# EAGLE board tester (EAGLE 6.4)
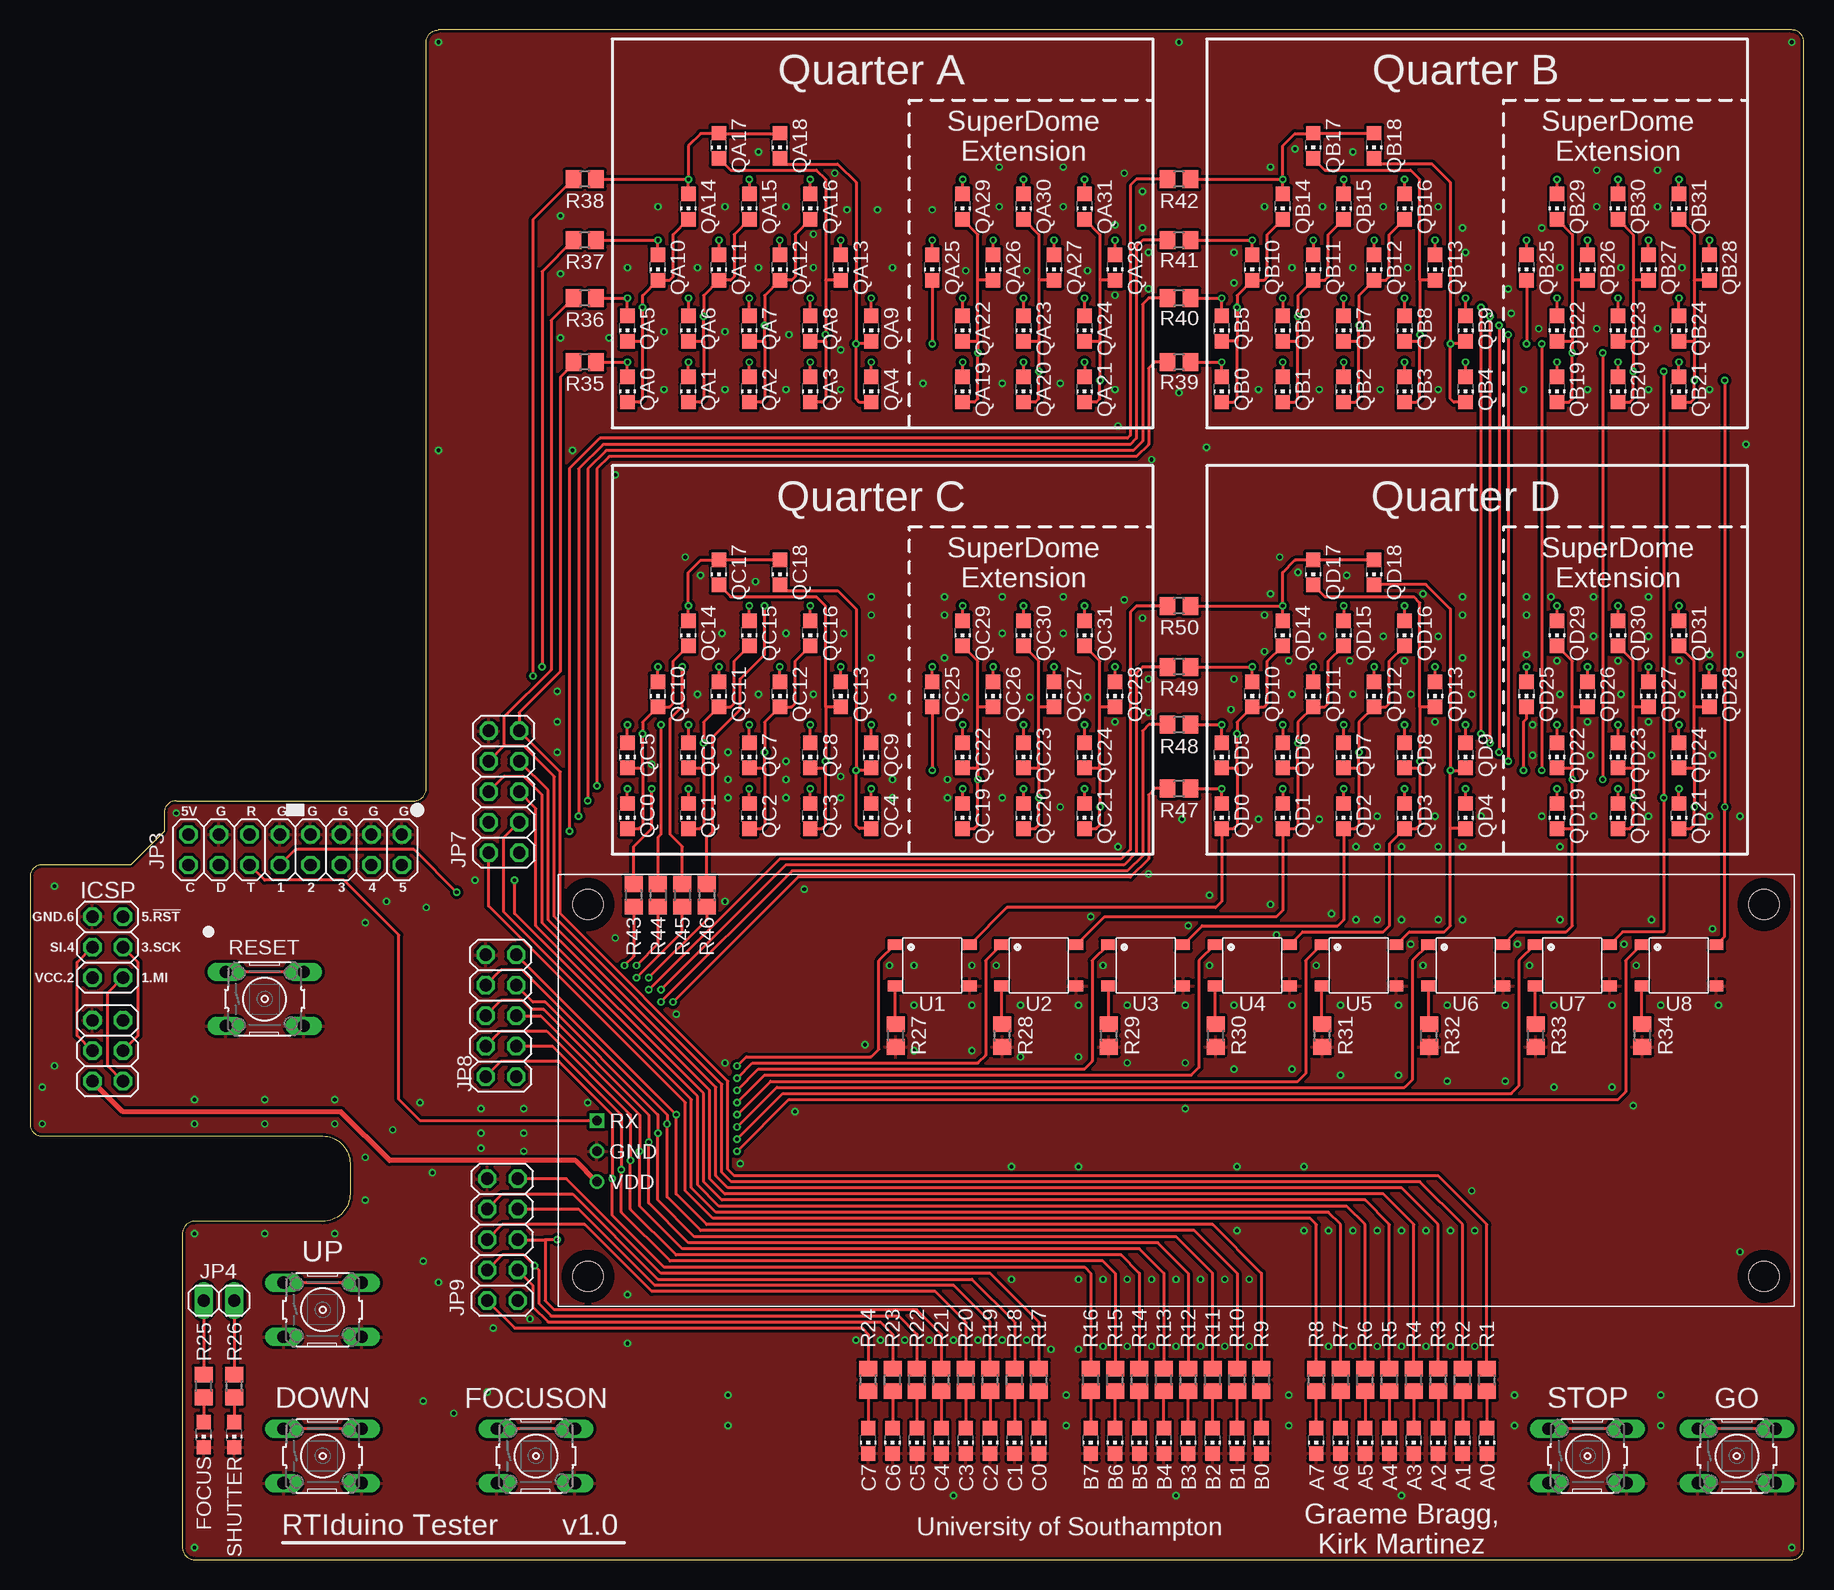
[diagram p2: board, top side]
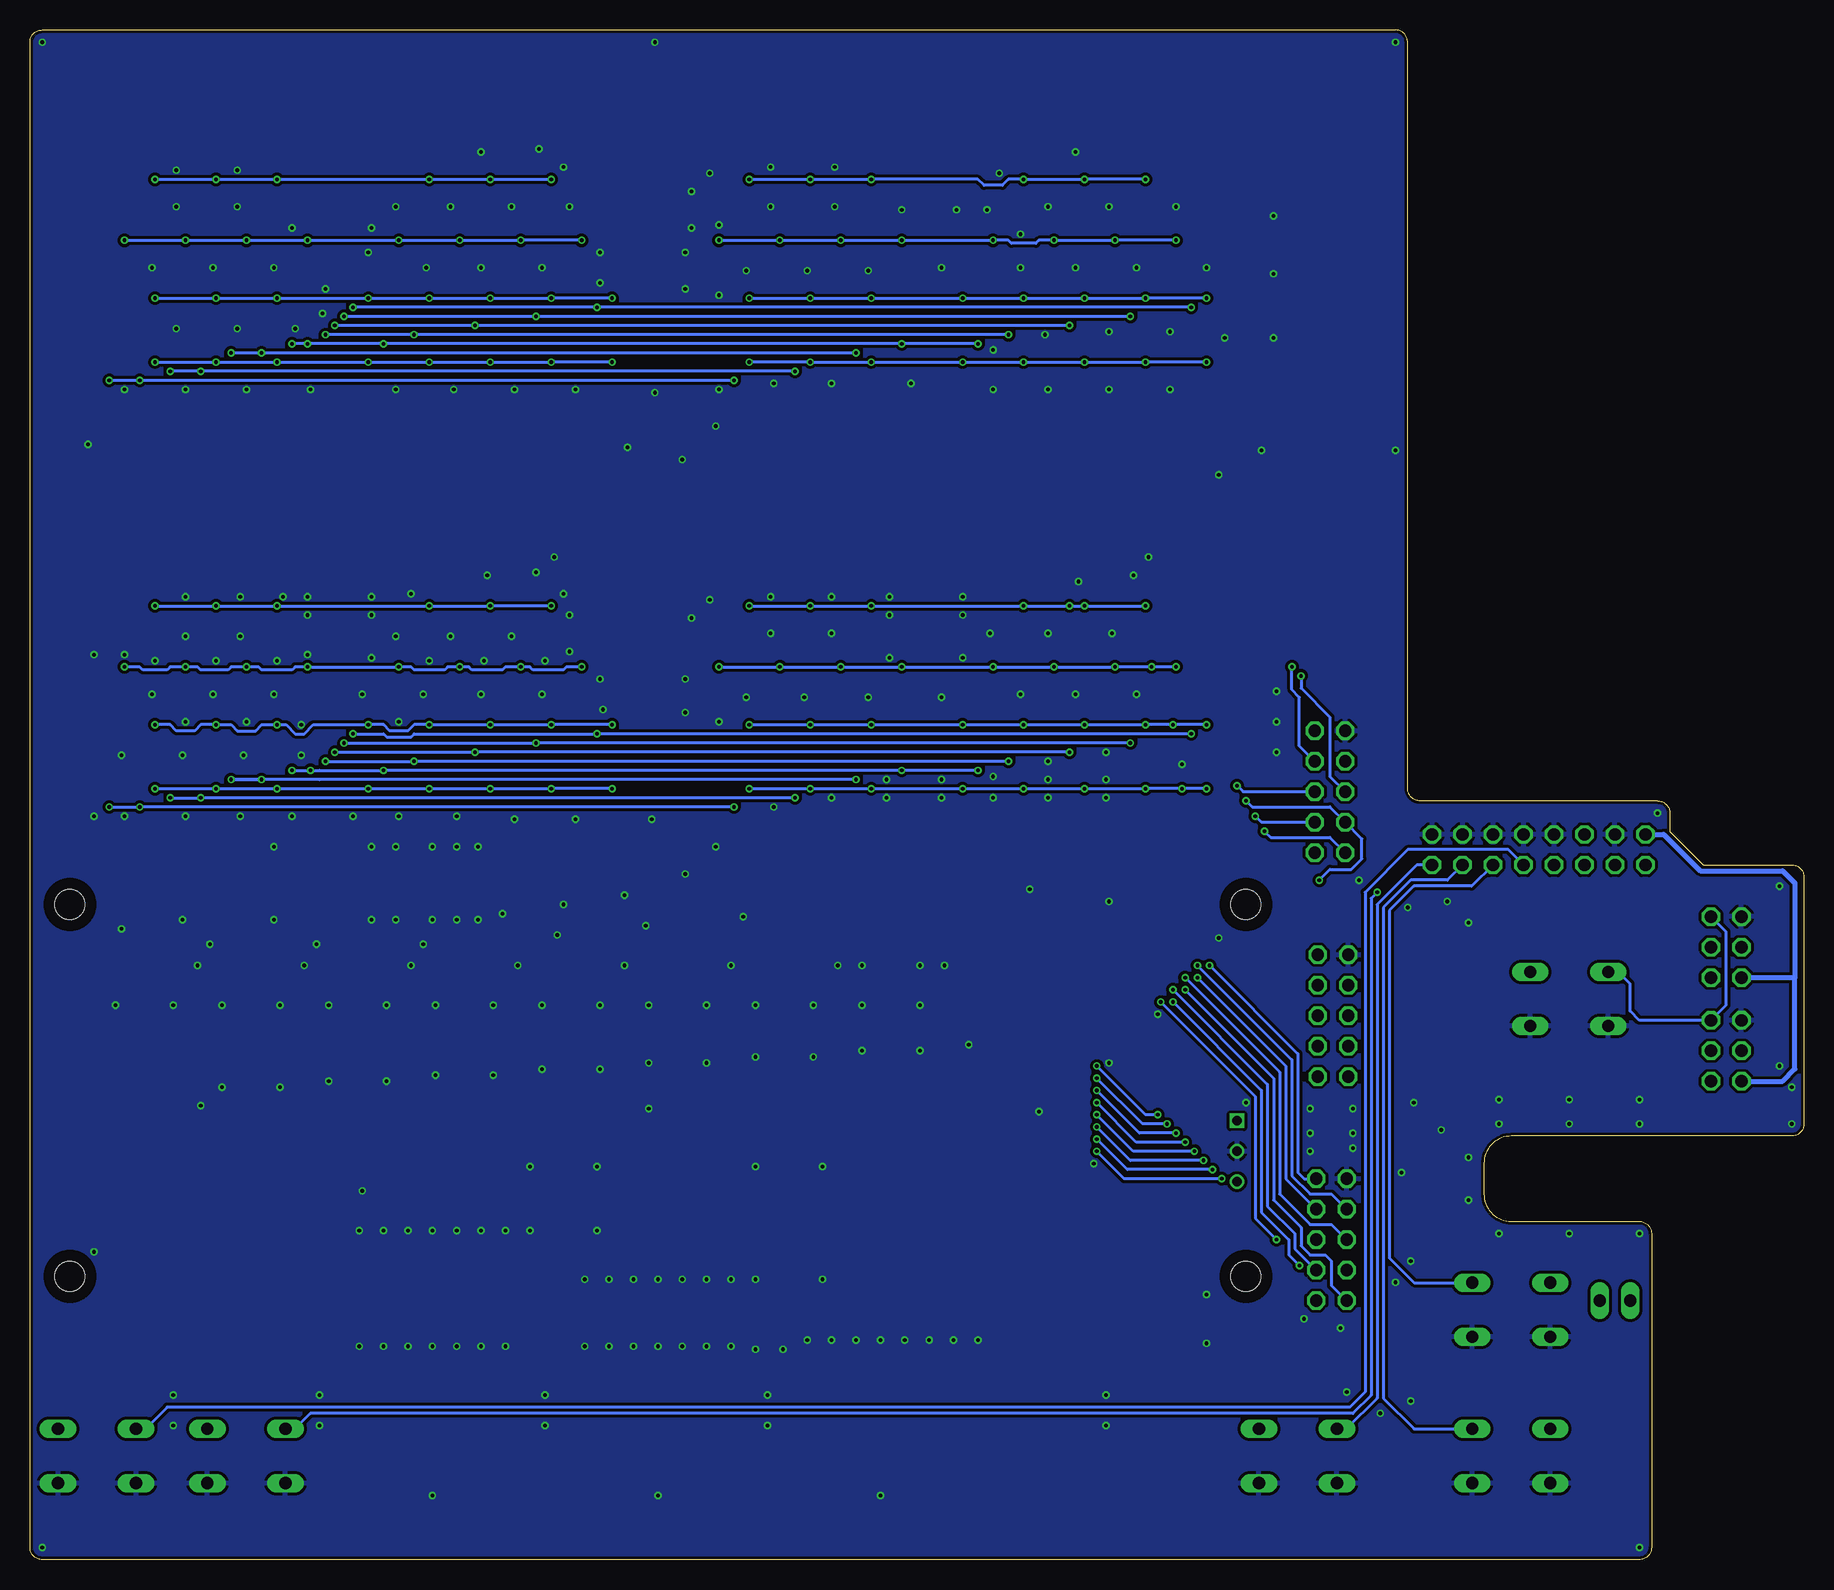
[diagram p3: board, bottom side, seen from below]

Size 147.83 x 127.51 mm. Coordinates in mm from the lower left corner, seen from the top.
Outline: 12.19,63.25 arc90 11.18,62.23 11.18,60.71 8.38,57.91 1.02,57.91 arc90 0,56.9 0,36.32 arc90 1.02,35.31 24.38,35.31 arc-90 26.67,33.02 26.67,30.48 arc-90 24.38,28.19 13.72,28.19 arc90 12.7,27.18 12.7,1.02 arc90 13.72,0 146.81,0 arc90 147.83,1.02 147.83,126.49 arc90 146.81,127.51 34.04,127.51 arc90 33.02,126.49 33.02,64.26 arc-90 32,63.25 12.19,63.25
Copper layers (1*16): Top 0.035559375mm / dielectric 1.6mm / Bottom 0.035559375mm
Design rules "jlcpcb2layer": minimum track width 5mil, minimum drill 12mil, track to track 5mil, track to pad 5mil, pad to pad 5mil, via to via 5mil, smd to smd 5mil, copper to edge 8mil, drill to drill 6mil, minimum pad ring 5mil, minimum via ring 3mil, stop-mask expansion 2.5mil, vias tented up to drill 0mil, thermal gap 10mil
Net classes: 0 default: width 0.203 mm, drill 0.2 mm, clearance 0.127 mm; 1 power: width 0.203 mm, drill 0.2 mm, clearance 0.127 mm; 2 gnd: width 0.203 mm, drill 0.2 mm, clearance 0.127 mm; 3 usbvcc: width 0.203 mm, drill 0.2 mm, clearance 0.127 mm
tRestrict: area 108.9,66.6 to 110.1,67.5; area 103.8,66.6 to 105,67.5; area 98.7,66.6 to 99.9,67.5; area 98.7,61.5 to 99.9,62.4; area 103.8,61.5 to 105,62.4; area 108.9,61.5 to 110.1,62.4; area 114,61.5 to 115.2,62.4; area 119,61.5 to 120.2,62.4; area 114,66.6 to 115.2,67.5; area 119,66.6 to 120.2,67.5; area 101.3,71.7 to 102.5,72.6; area 106.3,71.7 to 107.5,72.6; 140 more areas

## Footprints (pad centres in the part's own frame; a part is rotated, then mirrored left to right if it is on the bottom)
CHIP-LED0805 = smd 1.2 x 1.2: A 0,-1.05; C 0,1.05
B3F-10XX = drill 1.016 long: 1 -3.251,2.261; 2 3.251,2.261; 3 -3.251,-2.261; 4 3.251,-2.261
2X03 = drill 1.016 octagon: 1 -2.54,-1.27; 2 -2.54,1.27; 3 0,-1.27; 4 0,1.27; 5 2.54,-1.27; 6 2.54,1.27
2X08 = drill 1.016 octagon: 1 -8.89,-1.27; 2 -8.89,1.27; 3 -6.35,-1.27; 4 -6.35,1.27; 5 -3.81,-1.27; 6 -3.81,1.27; 7 -1.27,-1.27; 8 -1.27,1.27; 9 1.27,-1.27; 10 1.27,1.27; 11 3.81,-1.27; 12 3.81,1.27; 13 6.35,-1.27; 14 6.35,1.27; 15 8.89,-1.27; 16 8.89,1.27
1X02 = drill 1.016 long: 1 -1.27,0; 2 1.27,0
2X05 = drill 1.016 octagon: 1 -5.08,-1.27; 2 -5.08,1.27; 3 -2.54,-1.27; 4 -2.54,1.27; 5 0,-1.27; 6 0,1.27; 7 2.54,-1.27; 8 2.54,1.27; 9 5.08,-1.27; 10 5.08,1.27
LCD-09395 = drill 0.8 square: P$1 -48.26,-2.54 | drill 0.8: P$2 -48.26,-5.08; P$3 -48.26,-7.62 | hole 2.5: -49,15.5; -49,-15.5; 49,-15.5; 49,15.5
R0805 = smd 1.3 x 1.5: 1 -0.95,0; 2 0.95,0
SOP4 = smd 1.15 x 0.9: P$1 -3.125,1.72; P$2 -3.125,-1.72; P$3 3.125,-1.72; P$4 3.125,1.72

## Placement (x,y rotation side)
A0  Red  [CHIP-LED0805]  121.41,9.91 180 top
A1  Red  [CHIP-LED0805]  119.38,9.91 180 top
A2  Red  [CHIP-LED0805]  117.35,9.91 180 top
A3  Red  [CHIP-LED0805]  115.32,9.91 180 top
A4  Red  [CHIP-LED0805]  113.28,9.91 180 top
A5  Red  [CHIP-LED0805]  111.25,9.91 180 top
A6  Red  [CHIP-LED0805]  109.22,9.91 180 top
A7  Red  [CHIP-LED0805]  107.19,9.91 180 top
B0  Orange  [CHIP-LED0805]  102.62,9.91 180 top
B1  Orange  [CHIP-LED0805]  100.58,9.91 180 top
B2  Orange  [CHIP-LED0805]  98.55,9.91 180 top
B3  Orange  [CHIP-LED0805]  96.52,9.91 180 top
B4  Orange  [CHIP-LED0805]  94.49,9.91 180 top
B5  Orange  [CHIP-LED0805]  92.46,9.91 180 top
B6  Orange  [CHIP-LED0805]  90.42,9.91 180 top
B7  Orange  [CHIP-LED0805]  88.39,9.91 180 top
C0  Red  [CHIP-LED0805]  84.07,9.91 180 top
C1  Red  [CHIP-LED0805]  82.04,9.91 180 top
C2  Red  [CHIP-LED0805]  80.01,9.91 180 top
C3  Red  [CHIP-LED0805]  77.98,9.91 180 top
C4  Red  [CHIP-LED0805]  75.95,9.91 180 top
C5  Red  [CHIP-LED0805]  73.91,9.91 180 top
C6  Red  [CHIP-LED0805]  71.88,9.91 180 top
C7  Red  [CHIP-LED0805]  69.85,9.91 180 top
DOWN  DOWN  [B3F-10XX]  24.38,8.64 0 top
FOCUS  Red  [CHIP-LED0805]  14.48,10.41 180 top
FOCUSON  FOCUS  [B3F-10XX]  42.16,8.64 0 top
GO  GO  [B3F-10XX]  142.24,8.64 0 top
ICSP  ICSP  [2X03]  6.48,42.42 90 top
ICSP1  ICSP  [2X03]  6.48,51.05 90 top
JP3  [2X08]  22.1,59.18 0 top
JP4  [1X02]  15.75,21.59 0 top
JP7  [2X05]  39.5,64.01 90 top
JP8  [2X05]  39.24,45.34 90 top
JP9  [2X05]  39.37,26.67 90 top
LCD1  LCD-09395  [LCD-09395]  95.5,39.12 0 top
QA0  Green  [CHIP-LED0805]  49.78,97.54 180 top
QA1  Green  [CHIP-LED0805]  54.86,97.54 180 top
QA2  Green  [CHIP-LED0805]  59.94,97.54 180 top
QA3  Green  [CHIP-LED0805]  65.02,97.54 180 top
QA4  Green  [CHIP-LED0805]  70.1,97.54 180 top
QA5  Green  [CHIP-LED0805]  49.78,102.62 180 top
QA6  Green  [CHIP-LED0805]  54.86,102.62 180 top
QA7  Green  [CHIP-LED0805]  59.94,102.62 180 top
QA8  Green  [CHIP-LED0805]  65.02,102.62 180 top
QA9  Green  [CHIP-LED0805]  70.1,102.62 180 top
QA10  Green  [CHIP-LED0805]  52.32,107.7 180 top
QA11  Green  [CHIP-LED0805]  57.4,107.7 180 top
QA12  Green  [CHIP-LED0805]  62.48,107.7 180 top
QA13  Green  [CHIP-LED0805]  67.56,107.7 180 top
QA14  Green  [CHIP-LED0805]  54.86,112.78 180 top
QA15  Green  [CHIP-LED0805]  59.94,112.78 180 top
QA16  Green  [CHIP-LED0805]  65.02,112.78 180 top
QA17  Green  [CHIP-LED0805]  57.4,117.86 180 top
QA18  Green  [CHIP-LED0805]  62.48,117.86 180 top
QA19  Yellow  [CHIP-LED0805]  77.72,97.54 180 top
QA20  Yellow  [CHIP-LED0805]  82.8,97.54 180 top
QA21  Yellow  [CHIP-LED0805]  87.88,97.54 180 top
QA22  Yellow  [CHIP-LED0805]  77.72,102.62 180 top
QA23  Yellow  [CHIP-LED0805]  82.8,102.62 180 top
QA24  Yellow  [CHIP-LED0805]  87.88,102.62 180 top
QA25  Yellow  [CHIP-LED0805]  75.18,107.7 180 top
QA26  Yellow  [CHIP-LED0805]  80.26,107.7 180 top
QA27  Yellow  [CHIP-LED0805]  85.34,107.7 180 top
QA28  Yellow  [CHIP-LED0805]  90.42,107.7 180 top
QA29  Yellow  [CHIP-LED0805]  77.72,112.78 180 top
QA30  Yellow  [CHIP-LED0805]  82.8,112.78 180 top
QA31  Yellow  [CHIP-LED0805]  87.88,112.78 180 top
QB0  Green  [CHIP-LED0805]  99.31,97.54 180 top
QB1  Green  [CHIP-LED0805]  104.39,97.54 180 top
QB2  Green  [CHIP-LED0805]  109.47,97.54 180 top
QB3  Green  [CHIP-LED0805]  114.55,97.54 180 top
QB4  Green  [CHIP-LED0805]  119.63,97.54 180 top
QB5  Green  [CHIP-LED0805]  99.31,102.62 180 top
QB6  Green  [CHIP-LED0805]  104.39,102.62 180 top
QB7  Green  [CHIP-LED0805]  109.47,102.62 180 top
QB8  Green  [CHIP-LED0805]  114.55,102.62 180 top
QB9  Green  [CHIP-LED0805]  119.63,102.62 180 top
QB10  Green  [CHIP-LED0805]  101.85,107.7 180 top
QB11  Green  [CHIP-LED0805]  106.93,107.7 180 top
QB12  Green  [CHIP-LED0805]  112.01,107.7 180 top
QB13  Green  [CHIP-LED0805]  117.09,107.7 180 top
QB14  Green  [CHIP-LED0805]  104.39,112.78 180 top
QB15  Green  [CHIP-LED0805]  109.47,112.78 180 top
QB16  Green  [CHIP-LED0805]  114.55,112.78 180 top
QB17  Green  [CHIP-LED0805]  106.93,117.86 180 top
QB18  Green  [CHIP-LED0805]  112.01,117.86 180 top
QB19  Yellow  [CHIP-LED0805]  127.25,97.54 180 top
QB20  Yellow  [CHIP-LED0805]  132.33,97.54 180 top
QB21  Yellow  [CHIP-LED0805]  137.41,97.54 180 top
QB22  Yellow  [CHIP-LED0805]  127.25,102.62 180 top
QB23  Yellow  [CHIP-LED0805]  132.33,102.62 180 top
QB24  Yellow  [CHIP-LED0805]  137.41,102.62 180 top
QB25  Yellow  [CHIP-LED0805]  124.71,107.7 180 top
QB26  Yellow  [CHIP-LED0805]  129.79,107.7 180 top
QB27  Yellow  [CHIP-LED0805]  134.87,107.7 180 top
QB28  Yellow  [CHIP-LED0805]  139.95,107.7 180 top
QB29  Yellow  [CHIP-LED0805]  127.25,112.78 180 top
QB30  Yellow  [CHIP-LED0805]  132.33,112.78 180 top
QB31  Yellow  [CHIP-LED0805]  137.41,112.78 180 top
QC0  Green  [CHIP-LED0805]  49.78,61.98 180 top
QC1  Green  [CHIP-LED0805]  54.86,61.98 180 top
QC2  Green  [CHIP-LED0805]  59.94,61.98 180 top
QC3  Green  [CHIP-LED0805]  65.02,61.98 180 top
QC4  Green  [CHIP-LED0805]  70.1,61.98 180 top
QC5  Green  [CHIP-LED0805]  49.78,67.06 180 top
QC6  Green  [CHIP-LED0805]  54.86,67.06 180 top
QC7  Green  [CHIP-LED0805]  59.94,67.06 180 top
QC8  Green  [CHIP-LED0805]  65.02,67.06 180 top
QC9  Green  [CHIP-LED0805]  70.1,67.06 180 top
QC10  Green  [CHIP-LED0805]  52.32,72.14 180 top
QC11  Green  [CHIP-LED0805]  57.4,72.14 180 top
QC12  Green  [CHIP-LED0805]  62.48,72.14 180 top
QC13  Green  [CHIP-LED0805]  67.56,72.14 180 top
QC14  Green  [CHIP-LED0805]  54.86,77.22 180 top
QC15  Green  [CHIP-LED0805]  59.94,77.22 180 top
QC16  Green  [CHIP-LED0805]  65.02,77.22 180 top
QC17  Green  [CHIP-LED0805]  57.4,82.3 180 top
QC18  Green  [CHIP-LED0805]  62.48,82.3 180 top
QC19  Yellow  [CHIP-LED0805]  77.72,61.98 180 top
QC20  Yellow  [CHIP-LED0805]  82.8,61.98 180 top
QC21  Yellow  [CHIP-LED0805]  87.88,61.98 180 top
QC22  Yellow  [CHIP-LED0805]  77.72,67.06 180 top
QC23  Yellow  [CHIP-LED0805]  82.8,67.06 180 top
QC24  Yellow  [CHIP-LED0805]  87.88,67.06 180 top
QC25  Yellow  [CHIP-LED0805]  75.18,72.14 180 top
QC26  Yellow  [CHIP-LED0805]  80.26,72.14 180 top
QC27  Yellow  [CHIP-LED0805]  85.34,72.14 180 top
QC28  Yellow  [CHIP-LED0805]  90.42,72.14 180 top
QC29  Yellow  [CHIP-LED0805]  77.72,77.22 180 top
QC30  Yellow  [CHIP-LED0805]  82.8,77.22 180 top
QC31  Yellow  [CHIP-LED0805]  87.88,77.22 180 top
QD0  Green  [CHIP-LED0805]  99.31,61.98 180 top
QD1  Green  [CHIP-LED0805]  104.39,61.98 180 top
QD2  Green  [CHIP-LED0805]  109.47,61.98 180 top
QD3  Green  [CHIP-LED0805]  114.55,61.98 180 top
QD4  Green  [CHIP-LED0805]  119.63,61.98 180 top
QD5  Green  [CHIP-LED0805]  99.31,67.06 180 top
QD6  Green  [CHIP-LED0805]  104.39,67.06 180 top
QD7  Green  [CHIP-LED0805]  109.47,67.06 180 top
QD8  Green  [CHIP-LED0805]  114.55,67.06 180 top
QD9  Green  [CHIP-LED0805]  119.63,67.06 180 top
QD10  Green  [CHIP-LED0805]  101.85,72.14 180 top
QD11  Green  [CHIP-LED0805]  106.93,72.14 180 top
QD12  Green  [CHIP-LED0805]  112.01,72.14 180 top
QD13  Green  [CHIP-LED0805]  117.09,72.14 180 top
QD14  Green  [CHIP-LED0805]  104.39,77.22 180 top
QD15  Green  [CHIP-LED0805]  109.47,77.22 180 top
QD16  Green  [CHIP-LED0805]  114.55,77.22 180 top
QD17  Green  [CHIP-LED0805]  106.93,82.3 180 top
QD18  Green  [CHIP-LED0805]  112.01,82.3 180 top
QD19  Yellow  [CHIP-LED0805]  127.25,61.98 180 top
QD20  Yellow  [CHIP-LED0805]  132.33,61.98 180 top
QD21  Yellow  [CHIP-LED0805]  137.41,61.98 180 top
QD22  Yellow  [CHIP-LED0805]  127.25,67.06 180 top
QD23  Yellow  [CHIP-LED0805]  132.33,67.06 180 top
QD24  Yellow  [CHIP-LED0805]  137.41,67.06 180 top
QD25  Yellow  [CHIP-LED0805]  124.71,72.14 180 top
QD26  Yellow  [CHIP-LED0805]  129.79,72.14 180 top
QD27  Yellow  [CHIP-LED0805]  134.87,72.14 180 top
QD28  Yellow  [CHIP-LED0805]  139.95,72.14 180 top
QD29  Yellow  [CHIP-LED0805]  127.25,77.22 180 top
QD30  Yellow  [CHIP-LED0805]  132.33,77.22 180 top
QD31  Yellow  [CHIP-LED0805]  137.41,77.22 180 top
R1  200  [R0805]  121.41,14.99 90 top
R2  200  [R0805]  119.38,14.99 90 top
R3  200  [R0805]  117.35,14.99 90 top
R4  200  [R0805]  115.32,14.99 90 top
R5  200  [R0805]  113.28,14.99 90 top
R6  200  [R0805]  111.25,14.99 90 top
R7  200  [R0805]  109.22,14.99 90 top
R8  200  [R0805]  107.19,14.99 90 top
R9  200  [R0805]  102.62,14.99 90 top
R10  200  [R0805]  100.58,14.99 90 top
R11  200  [R0805]  98.55,14.99 90 top
R12  200  [R0805]  96.52,14.99 90 top
R13  200  [R0805]  94.49,14.99 90 top
R14  200  [R0805]  92.46,14.99 90 top
R15  200  [R0805]  90.42,14.99 90 top
R16  200  [R0805]  88.39,14.99 90 top
R17  200  [R0805]  84.07,14.99 90 top
R18  200  [R0805]  82.04,14.99 90 top
R19  200  [R0805]  80.01,14.99 90 top
R20  200  [R0805]  77.98,14.99 90 top
R21  200  [R0805]  75.95,14.99 90 top
R22  200  [R0805]  73.91,14.99 90 top
R23  200  [R0805]  71.88,14.99 90 top
R24  200  [R0805]  69.85,14.99 90 top
R25  200  [R0805]  14.48,14.48 90 top
R26  200  [R0805]  17.02,14.48 90 top
R27  768  [R0805]  72.14,43.69 90 top
R28  768  [R0805]  81.03,43.69 90 top
R29  768  [R0805]  89.92,43.69 90 top
R30  768  [R0805]  98.81,43.69 90 top
R31  768  [R0805]  107.7,43.69 90 top
R32  768  [R0805]  116.59,43.69 90 top
R33  768  [R0805]  125.48,43.69 90 top
R34  768  [R0805]  134.37,43.69 90 top
R35  187  [R0805]  46.23,99.82 180 top
R36  187  [R0805]  46.23,105.16 180 top
R37  187  [R0805]  46.23,109.98 180 top
R38  187  [R0805]  46.23,115.06 180 top
R39  187  [R0805]  95.76,99.82 180 top
R40  187  [R0805]  95.76,105.16 180 top
R41  187  [R0805]  95.76,109.98 180 top
R42  187  [R0805]  95.76,115.06 180 top
R43  187  [R0805]  50.29,55.37 270 top
R44  187  [R0805]  52.32,55.37 270 top
R45  187  [R0805]  54.36,55.37 270 top
R46  187  [R0805]  56.39,55.37 270 top
R47  187  [R0805]  95.76,64.26 180 top
R48  187  [R0805]  95.76,69.6 180 top
R49  187  [R0805]  95.76,74.42 180 top
R50  187  [R0805]  95.76,79.5 180 top
RESET  RESET  [B3F-10XX]  19.56,46.74 0 top
SHUTTER  Red  [CHIP-LED0805]  17.02,10.41 180 top
STOP  STOP  [B3F-10XX]  129.79,8.64 0 top
U1  VO1400AEFTR  [SOP4]  75.18,49.53 0 top
U2  VO1400AEFTR  [SOP4]  84.07,49.53 0 top
U3  VO1400AEFTR  [SOP4]  92.96,49.53 0 top
U4  VO1400AEFTR  [SOP4]  101.85,49.53 0 top
U5  VO1400AEFTR  [SOP4]  110.74,49.53 0 top
U6  VO1400AEFTR  [SOP4]  119.63,49.53 0 top
U7  VO1400AEFTR  [SOP4]  128.52,49.53 0 top
U8  VO1400AEFTR  [SOP4]  137.41,49.53 0 top
UP  UP  [B3F-10XX]  24.38,20.83 0 top

## Tracks (layer width: path | path; a pad name or v marks a point on that pad's centre or on a via)
+5V
  Top 0.406: LCD1.P$3 45.47,33.27 29.97,33.27 25.91,37.34 7.75,37.34 ICSP.2
  Bottom 0.406: JP3.2 11.68,60.45 8.64,57.4 1.78,57.4 0.76,56.39 0.76,48.51 | ICSP1.2 0.76,48.51 | ICSP.2 1.78,39.88 0.76,40.89 0.76,48.51
A0
  Top 0.254: R1.2 121.41,27.94 117.35,32 58.67,32 58.17,32.51 58.17,39.88 44.2,53.85 44.2,65.66 JP7.9 40.77,70.61 44.2,74.04 44.2,98.55 45.28,99.63 R35.2
A1
  Top 0.254: R2.2 119.38,27.94 115.82,31.5 58.42,31.5 57.66,32.26 57.66,39.62 43.69,53.59 43.69,65.28 41.15,67.82 39.5,67.82 | 39.5,67.82 JP7.8 | R36.2 43.43,103.31 43.43,74.17 39.5,70.23 39.5,67.82
A2  (via drill 0.3 pad 0.61)
  Top 0.254: R3.2 117.35,27.94 114.3,30.99 58.17,30.99 57.15,32 57.15,39.37 43.18,53.34 43.18,64.14 JP7.7 | R37.2 42.67,107.38 v42.67,74.42
  Bottom 0.254: JP7.7 42.04,67.82 42.04,71.88 42.67,72.52 v42.67,74.42
A3  (via drill 0.3 pad 0.61)
  Top 0.254: R4.2 115.32,27.94 112.78,30.48 57.91,30.48 56.64,31.75 56.64,39.12 42.67,53.09 42.67,63.75 41.15,65.28 39.5,65.28 JP7.6 | R38.2 41.91,111.69 v41.91,73.66
  Bottom 0.254: v41.91,73.66 41.91,72.64 39.5,70.23 39.5,65.28 JP7.6
A4  (via drill 0.3 pad 0.61)
  Top 0.254: R5.2 113.28,27.94 111.25,29.97 57.66,29.97 56.13,31.5 56.13,38.86 42.16,52.83 42.16,62.61 JP7.5 | R39.2 93.73,99.82 93.22,99.31 93.22,92.96 92.2,91.95 48.26,91.95 47.24,90.93 v47.24,64.52
  Bottom 0.254: JP7.5 46.74,64.01 v47.24,64.52
A5  (via drill 0.3 pad 0.61)
  Top 0.254: R6.2 111.25,27.94 109.73,29.46 57.4,29.46 55.63,31.24 55.63,38.61 40.39,53.85 v40.39,56.64 | R40.2 93.22,105.16 92.71,104.65 92.71,93.22 91.95,92.46 48.01,92.46 46.48,90.93 v46.48,63.25
  Bottom 0.254: v40.39,56.64 39.5,57.53 37.72,57.53 36.83,58.42 36.83,60.07 JP7.4 39.5,62.74 45.97,62.74 v46.48,63.25
A6  (via drill 0.3 pad 0.61)
  Top 0.254: R7.2 109.22,27.94 108.2,28.96 57.15,28.96 55.12,30.99 55.12,38.35 39.5,53.98 39.5,60.2 JP7.3 | R41.2 92.71,109.98 92.2,109.47 92.2,93.47 91.69,92.96 47.75,92.96 45.72,90.93 v45.72,61.98
  Bottom 0.254: v45.72,61.98 45.21,61.47 JP7.3
A7  (via drill 0.3 pad 0.61)
  Top 0.254: R8.2 107.19,27.94 106.68,28.45 56.9,28.45 54.61,30.73 54.61,38.1 38.23,54.48 JP7.2 | R42.2 92.2,115.06 91.69,114.55 91.69,93.73 91.44,93.47 47.5,93.47 44.96,90.93 v44.96,60.71
  Bottom 0.254: v44.96,60.71 44.45,60.2 39.5,60.2 JP7.2
B0  (via drill 0.3 pad 0.61)
  Top 0.254: R9.2 102.62,23.88 98.55,27.94 56.39,27.94 53.85,30.48 v53.85,37.08 JP8.9 | U1.P$1 70.74,49.93 70.74,42.55 70.1,41.91 59.69,41.91 v58.93,41.15
  Bottom 0.254: v53.85,37.08 54.86,37.08 v58.93,41.15
B1  (via drill 0.3 pad 0.61)
  Top 0.254: JP8.8 39.24,49.15 41.02,49.15 53.09,37.08 v53.09,36.32 53.09,30.23 55.88,27.43 97.03,27.43 100.58,23.88 R10.2 | U2.P$1 79.63,49.93 79.63,42.04 78.99,41.4 60.2,41.4 v58.93,40.13
  Bottom 0.254: v53.09,36.32 55.12,36.32 v58.93,40.13
B2  (via drill 0.3 pad 0.61)
  Top 0.254: R11.2 98.55,23.88 95.5,26.92 55.37,26.92 52.32,29.97 v52.32,35.56 52.32,37.08 42.93,46.48 41.91,46.48 JP8.7 | U3.P$1 88.52,49.93 88.52,41.53 87.88,40.89 60.71,40.89 v58.93,39.12
  Bottom 0.254: v52.32,35.56 55.37,35.56 v58.93,39.12
B3  (via drill 0.3 pad 0.61)
  Top 0.254: JP8.6 39.24,46.61 41.02,46.61 41.78,45.85 42.8,45.85 51.56,37.08 v51.56,34.8 51.56,29.72 54.86,26.42 93.98,26.42 96.52,23.88 R12.2 | U4.P$1 97.41,49.93 97.41,41.02 96.77,40.39 61.21,40.39 v58.93,38.1
  Bottom 0.254: v51.56,34.8 55.63,34.8 v58.93,38.1
B4  (via drill 0.3 pad 0.61)
  Top 0.254: R13.2 94.49,23.88 92.46,25.91 54.36,25.91 50.8,29.46 v50.8,34.04 50.8,37.08 42.55,45.34 JP8.5 | v58.93,37.08 61.72,39.88 105.66,39.88 106.3,40.51 106.3,49.93 U5.P$1
  Bottom 0.254: v50.8,34.04 55.88,34.04 v58.93,37.08
B5  (via drill 0.3 pad 0.61)
  Top 0.254: JP8.4 39.24,44.07 43.05,44.07 50.04,37.08 v50.04,33.27 50.04,29.21 53.85,25.4 90.93,25.4 92.46,23.88 R14.2 | v58.93,36.07 62.23,39.37 114.55,39.37 115.19,40.01 115.19,49.93 U6.P$1
  Bottom 0.254: v50.04,33.27 56.13,33.27 v58.93,36.07
B6  (via drill 0.3 pad 0.61)
  Top 0.254: R15.2 90.42,23.88 89.41,24.89 53.34,24.89 49.28,28.96 v49.28,32.51 49.28,37.08 43.56,42.8 JP8.3 | v58.93,35.05 62.74,38.86 123.44,38.86 124.08,39.5 124.08,49.93 U7.P$1
  Bottom 0.254: v49.28,32.51 56.39,32.51 v58.93,35.05
B7  (via drill 0.3 pad 0.61)
  Top 0.254: R16.2 88.39,23.88 87.88,24.38 52.83,24.38 48.51,28.7 v48.51,31.75 48.51,37.08 44.07,41.53 39.24,41.53 JP8.2 | v58.93,34.04 63.25,38.35 132.33,38.35 132.97,38.99 132.97,49.93 U8.P$1
  Bottom 0.254: v48.51,31.75 56.64,31.75 v58.93,34.04
C0  (via drill 0.3 pad 0.61)
  Top 0.254: R17.2 84.07,19.81 80.01,23.88 52.58,23.88 44.7,31.75 JP9.9 | R43.2 50.29,50.29 v49.53,49.53
  Bottom 0.254: v49.53,49.53 42.16,42.16 42.16,32.26 41.66,31.75 JP9.9
C1  (via drill 0.3 pad 0.61)
  Top 0.254: R18.2 82.04,19.81 78.49,23.37 52.32,23.37 45.21,30.48 39.37,30.48 JP9.8 | R44.2 52.32,51.31 v50.55,49.53
  Bottom 0.254: v50.55,49.53 42.67,41.66 42.67,32 41.15,30.48 39.37,30.48 JP9.8
C2  (via drill 0.3 pad 0.61)
  Top 0.254: v50.55,48.51 54.36,52.32 R45.2 | R19.2 80.01,19.81 76.96,22.86 52.07,22.86 45.72,29.21 JP9.7
  Bottom 0.254: v50.55,48.51 43.18,41.15 43.18,31.75 JP9.7
C3  (via drill 0.3 pad 0.61)
  Top 0.254: R20.2 77.98,19.81 75.44,22.35 51.82,22.35 46.23,27.94 39.37,27.94 JP9.6 | v51.56,48.51 56.39,53.34 R46.2
  Bottom 0.254: v51.56,48.51 43.69,40.64 43.69,30.48 41.15,27.94 39.37,27.94 JP9.6
C4  (via drill 0.3 pad 0.61)
  Top 0.254: 42.93,26.67 42.93,21.59 43.69,20.83 73.91,20.83 75.95,18.8 R21.2 | R47.2 93.73,64.26 93.22,63.75 93.22,58.42 91.69,56.9 64.01,56.9 v53.59,46.48 | JP9.5 42.93,26.67 | v43.94,26.67 42.93,26.67
  Bottom 0.254: v53.59,46.48 45.72,38.61 45.72,28.45 v43.94,26.67
C5  (via drill 0.3 pad 0.61)
  Top 0.254: JP9.4 39.37,25.4 41.15,25.4 v42.04,24.51 42.42,24.13 42.42,21.34 43.43,20.32 72.39,20.32 73.91,18.8 R22.2 | R48.2 93.22,69.6 92.71,69.09 92.71,58.67 91.44,57.4 63.5,57.4 v52.58,46.48
  Bottom 0.254: v52.58,46.48 45.21,39.12 45.21,28.96 42.93,26.67 42.93,25.4 v42.04,24.51
C6  (via drill 0.3 pad 0.61)
  Top 0.254: R23.2 71.88,18.8 70.87,19.81 43.18,19.81 41.91,21.08 41.91,22.86 JP9.3 | R49.2 92.71,74.42 92.2,73.91 92.2,58.93 91.19,57.91 62.99,57.91 v52.58,47.5
  Bottom 0.254: v52.58,47.5 44.7,39.62 44.7,29.46 42.42,27.18 42.42,25.91 JP9.3
C7  (via drill 0.3 pad 0.61)
  Top 0.254: R24.2 69.85,18.8 69.34,19.3 40.39,19.3 JP9.2 | R50.2 92.2,79.5 91.69,78.99 91.69,59.18 90.93,58.42 62.48,58.42 v51.56,47.5
  Bottom 0.254: v51.56,47.5 44.2,40.13 44.2,29.97 41.91,27.69 41.91,26.16 41.15,25.4 39.88,25.4 39.37,24.89 39.37,22.86 JP9.2
FOCUS
  Top 0.254: JP4.1 R25.2
G0  (via drill 0.3 pad 0.61)
  Top 0.254: 49.82,96.52 QA0.C 50.77,96.49 51.05,96.77 v51.05,104.39 | v51.05,104.39 51.05,105.38 QA10.C 53.31,106.65 53.59,106.93 53.59,110.46 QA14.C | QA5.C 51.05,101.57 v51.05,104.39 | 51.05,66.01 51.05,61.21 50.77,60.93 QC0.C | 100.58,66.01 100.58,61.21 100.3,60.93 QD0.C 99.31,54.86 98.81,54.36 81.42,54.36 U1.P$4 | QB0.C 100.3,96.49 100.58,96.77 100.58,101.57 | QD5.C 100.58,66.01 | QB14.C 103.12,110.46 103.12,106.93 102.84,106.65 QB10.C 100.58,105.38 v100.58,104.39 100.58,101.57 | QC14.C 53.59,74.9 53.59,71.37 53.31,71.09 QC10.C 51.05,69.82 v51.05,68.83 51.05,66.01 | QD14.C 103.12,74.9 103.12,71.37 102.84,71.09 QD10.C 100.58,69.82 v100.58,68.83 100.58,66.01 | 100.58,101.57 QB5.C | QC5.C 51.05,66.01 | v120.9,104.39 v120.9,68.83
  Bottom 0.254: v51.05,104.39 v100.58,104.39 v120.9,104.39 | v51.05,68.83 v100.58,68.83 115.82,68.83 116.08,68.58 118.11,68.58 118.36,68.83 v120.9,68.83
G1  (via drill 0.3 pad 0.61)
  Top 0.254: QA6.C 56.13,101.57 | 56.13,101.57 56.13,96.77 55.85,96.49 QA1.C | QA15.C 58.67,110.46 58.67,106.93 58.39,106.65 QA11.C 56.13,105.38 v56.13,103.63 56.13,101.57 | 56.13,66.01 56.13,61.21 55.85,60.93 QC1.C | 105.66,66.01 105.66,61.21 105.38,60.93 QD1.C 104.39,54.1 103.89,53.59 89.54,53.59 U2.P$4 | QB1.C 105.38,96.49 105.66,96.77 105.66,101.57 | QD6.C 105.66,66.01 | QB15.C 108.2,110.46 108.2,106.93 107.92,106.65 QB11.C 105.66,105.38 v105.66,103.63 105.66,101.57 | QC15.C 58.67,74.9 58.67,71.37 58.39,71.09 QC11.C 56.13,69.82 v56.13,68.07 56.13,66.01 | QD15.C 108.2,74.9 108.2,71.37 107.92,71.09 QD11.C 105.66,69.82 v105.66,68.07 105.66,66.01 | QB6.C 105.66,101.57 | QC6.C 56.13,66.01 | v121.67,103.63 v121.67,68.07
  Bottom 0.254: v56.13,103.63 v105.66,103.63 v121.67,103.63 | v56.13,68.07 v105.66,68.07 v121.67,68.07
G2  (via drill 0.3 pad 0.61)
  Top 0.254: QA16.C 63.75,110.46 63.75,106.93 63.47,106.65 QA12.C 61.21,105.38 v61.21,102.87 61.21,101.57 | 61.21,101.57 61.21,96.77 60.93,96.49 QA2.C | QA7.C 61.21,101.57 | 61.21,66.01 61.21,61.21 60.93,60.93 QC2.C | 110.74,66.01 110.74,61.21 110.46,60.93 QD2.C 109.47,53.34 108.97,52.83 97.67,52.83 U3.P$4 | QB2.C 110.46,96.49 110.74,96.77 110.74,101.57 | QD7.C 110.74,66.01 | QB16.C 113.28,110.46 113.28,106.93 113,106.65 QB12.C 110.74,105.38 v110.74,102.87 110.74,101.57 | QC16.C 63.75,74.9 63.75,71.37 63.47,71.09 QC12.C 61.21,69.82 v61.21,67.31 61.21,66.01 | QD16.C 113.28,74.9 113.28,71.37 113,71.09 QD12.C 110.74,69.82 v110.74,67.31 110.74,66.01 | QB7.C 110.74,101.57 | QC7.C 61.21,66.01 | v122.43,102.87 v122.43,67.31
  Bottom 0.254: v61.21,102.87 v110.74,102.87 v122.43,102.87 | v61.21,67.31 v110.74,67.31 v122.43,67.31
G3  (via drill 0.3 pad 0.61)
  Top 0.254: 66.29,101.57 66.29,96.77 66.01,96.49 QA3.C | QA8.C 66.29,101.57 | 66.29,106.65 66.29,115.06 65.53,115.82 58.39,115.82 QA17.C | QA13.C 66.29,106.65 | 115.82,66.01 115.82,61.21 115.54,60.93 QD3.C 113.28,59.66 113.28,52.83 112.78,52.32 106.05,52.32 U4.P$4 | QB3.C 115.54,96.49 115.82,96.77 115.82,101.57 | QC3.C 66.01,60.93 66.29,61.21 66.29,66.01 | QB17.C 107.92,115.82 115.06,115.82 115.82,115.06 115.82,106.65 | QC17.C 58.39,80.26 65.53,80.26 66.29,79.5 66.29,71.09 | QD17.C 107.92,80.26 115.32,80.26 115.82,79.76 115.82,71.09 | QB13.C 115.82,106.65 | QB8.C 115.82,101.57 | QC8.C 66.29,66.01 | QD8.C 115.82,66.01 | QC13.C 66.29,71.09 | 66.29,106.65 v66.29,102.11 66.29,101.57 | 115.82,101.57 v115.82,102.11 115.82,106.65 | QD13.C 115.82,71.09 | 115.82,71.09 v115.82,66.55 115.82,66.01 | 66.29,71.09 v66.29,66.55 66.29,66.01 | v123.19,102.11 v123.19,66.55
  Bottom 0.254: v66.29,102.11 v115.82,102.11 v123.19,102.11 | v66.29,66.55 v115.82,66.55 v123.19,66.55
G4  (via drill 0.3 pad 0.61)
  Top 0.254: v68.83,101.35 68.83,114.81 67.31,116.33 62.96,116.33 QA18.C | QA4.C 69.12,96.49 68.83,96.77 v68.83,101.35 | QB4.C 118.65,96.49 118.36,96.77 v118.36,101.35 | QC4.C 69.12,60.93 68.83,61.21 v68.83,65.79 | QD4.C 118.36,60.93 | QD18.C 112.01,81.28 116.33,81.28 118.36,79.25 v118.36,65.79 | QC18.C 62.96,80.77 67.31,80.77 68.83,79.25 v68.83,65.79 | QB18.C 112.01,116.33 116.84,116.33 118.36,114.81 v118.36,101.35 | QA9.C 70.1,101.35 v68.83,101.35 | QB9.C 119.41,101.35 v118.36,101.35 | QB25.C v124.71,101.35 | QA25.C v75.18,101.35 | QC9.C 69.88,65.79 v68.83,65.79 | 118.36,60.93 118.36,52.83 117.86,52.32 114.94,52.32 U5.P$4 | 118.36,60.93 v118.36,65.79 | v118.36,65.79 119.41,65.79 QD9.C | QC25.C v75.18,65.79 | v125.98,101.35 v125.98,65.79 | v124.46,65.79 124.46,69.85 124.71,70.1 QD25.C
  Bottom 0.254: v68.83,101.35 v75.18,101.35 v118.36,101.35 v125.98,101.35 v124.71,101.35 | v68.83,65.79 v75.18,65.79 v118.36,65.79 v125.98,65.79 v124.46,65.79 123.7,65.79
G5  (via drill 0.3 pad 0.61)
  Top 0.254: QA19.C 78.71,96.49 78.99,96.77 v78.99,100.58 78.99,101.57 | QA22.C 78.99,101.57 | 78.99,101.57 78.99,106.65 | 78.99,106.65 78.99,110.46 QA29.C | QA26.C 78.99,106.65 | 128.52,106.65 128.52,110.46 QB29.C | 128.52,106.65 128.52,101.57 | QB19.C 128.24,96.49 128.52,96.77 v128.52,100.58 128.52,101.57 | QC19.C 78.71,60.93 78.99,61.21 v78.99,65.02 78.99,66.01 | QD19.C 128.52,60.93 | QC22.C 78.99,66.01 | QD22.C 128.52,66.01 | 78.99,66.01 78.99,71.09 | 78.99,71.09 78.99,74.9 QC29.C | 128.52,66.01 128.52,71.09 | 128.52,71.09 128.52,74.9 QD29.C | QD26.C 128.52,71.09 | QC26.C 78.99,71.09 | QB26.C 128.52,106.65 | QB22.C 128.52,101.57 | 128.52,66.01 v128.52,65.02 128.52,60.93 | 128.52,60.93 128.52,52.83 128.02,52.32 123.83,52.32 U6.P$4 | v131.06,100.58 v131.06,65.02
  Bottom 0.254: v78.99,100.58 v131.06,100.58 v128.52,100.58 | v78.99,65.02 v131.06,65.02 v128.52,65.02 | 123.7,65.02 v128.52,65.02 | v128.52,65.02 128.78,65.02
G6  (via drill 0.3 pad 0.61)
  Top 0.254: QA30.C 84.07,110.46 84.07,106.65 | 84.07,106.65 84.07,101.57 | QA20.C 83.79,96.49 84.07,96.77 v84.07,99.06 84.07,101.57 | QA23.C 84.07,101.57 | QA27.C 84.07,106.65 | 133.6,106.65 133.6,110.46 QB30.C | 133.6,106.65 133.6,101.57 | QB20.C 133.32,96.49 133.6,96.77 v133.6,99.06 133.6,101.57 | QC20.C 83.79,60.93 84.07,61.21 v84.07,63.5 84.07,66.01 | QD20.C 133.32,60.93 133.6,61.21 v133.6,63.5 133.6,66.01 | QC23.C 84.07,66.01 | QD23.C 133.6,66.01 | 84.07,66.01 84.07,71.09 | 84.07,71.09 84.07,74.9 QC30.C | 133.6,66.01 133.6,71.09 | 133.6,71.09 133.6,74.9 QD30.C | QD27.C 133.6,71.09 | QC27.C 84.07,71.09 | QB27.C 133.6,106.65 | QB23.C 133.6,101.57 | v136.14,99.06 v136.14,63.5 136.14,52.32 132.72,52.32 U7.P$4
  Bottom 0.254: v84.07,99.06 v133.6,99.06 v136.14,99.06 | v84.07,63.5 v133.6,63.5 | v133.6,63.5 133.86,63.5 | v136.14,63.5 v133.6,63.5
G7  (via drill 0.3 pad 0.61)
  Top 0.254: QA31.C 89.15,110.46 89.15,106.65 | 89.15,106.65 89.15,101.57 | QA21.C 88.87,96.49 89.15,96.77 v89.15,98.3 89.15,101.57 | QA24.C 89.15,101.57 | QA28.C 89.15,106.65 | 138.68,106.65 138.68,110.46 QB31.C | 138.68,106.65 138.68,101.57 | QB21.C 138.4,96.49 138.68,96.77 v138.68,98.3 138.68,101.57 | QC21.C 88.87,60.93 89.15,61.21 v89.15,62.74 89.15,66.01 | QD21.C 138.4,60.93 138.68,61.21 v138.68,62.74 138.68,66.01 | QC24.C 89.15,66.01 | QD24.C 138.68,66.01 | 89.15,66.01 89.15,71.09 | 89.15,71.09 89.15,74.9 QC31.C | 138.68,66.01 138.68,71.09 | 138.68,71.09 138.68,74.9 QD31.C | QD28.C 138.68,71.09 | QC28.C 89.15,71.09 | QB28.C 138.68,106.65 | QB24.C 138.68,101.57 | v141.22,98.3 v141.22,62.74 141.22,51.94 U8.P$4
  Bottom 0.254: v89.15,98.3 v138.68,98.3 v141.22,98.3 | v89.15,62.74 v138.68,62.74 v141.22,62.74
GND  (via drill 0.3 pad 0.61)
  other vias: 105.16,46.23 114.05,46.23 122.94,46.23 131.83,46.23 96.27,46.23 87.38,46.23 78.49,46.23 59.18,33.02 37.59,34.29 37.59,35.56 41.15,35.56 41.15,34.04 41.15,37.59 37.59,37.59 43.94,72.39 43.94,67.31 43.94,69.85 112.27,53.34 110.49,53.34 110.49,59.44 112.27,59.44 112.27,61.98 115.06,72.14 117.35,76.96 116.08,80.52 114.55,74.93 127.25,74.93 127.51,72.14 124.71,75.44 67.82,77.22 125.22,69.6 125.22,67.06 132.33,74.93 132.59,72.14 129.79,69.85 142.49,25.65 130.05,67.06 134.87,69.85 134.87,76.96 137.41,74.93 137.67,72.14 139.95,75.44 91.19,80.01 134.87,80.26 130.3,80.26 130.3,76.96 126.75,80.26 117.09,69.85 117.09,61.98 117.35,53.34 114.3,53.34 114.3,59.44 117.35,59.44 119.38,59.44 119.38,53.34 127.51,53.34 127.51,59.44 125.98,61.98 120.9,61.98 78.49,42.42 73.66,42.42 73.66,46.23 78.49,49.53 73.66,49.53 71.63,49.53 80.52,49.53 89.41,49.53 98.3,49.53 107.19,49.53 116.08,49.53 124.97,49.53 133.86,49.53 87.38,41.91 96.27,41.4 105.16,40.89 114.05,40.39 122.94,39.88 131.83,39.37 108.46,53.85 103.38,54.61 98.3,55.37 53.85,45.47 57.91,41.4 46.48,38.1 87.38,23.37 81.79,23.37 89.41,23.37 91.44,23.37 93.47,23.37 95.5,23.37 97.54,23.37 99.57,23.37 101.6,23.37 106.17,27.43 100.58,27.43 108.2,27.43 110.24,27.43 112.27,27.43 114.3,27.43 116.33,27.43 118.36,27.43 120.4,27.43 108.2,17.78 110.24,17.78 112.27,17.78 114.3,17.78 116.33,17.78 118.36,17.78 120.4,17.78 101.6,17.78 99.57,17.78 97.54,17.78 95.5,17.78 93.47,17.78 91.44,17.78 89.41,17.78 68.83,18.29 70.87,18.29 72.9,18.29 74.93,18.29 76.96,18.29 78.99,18.29 81.03,18.29 83.06,18.29 87.38,17.53 85.09,17.53 87.38,32.77 106.17,32.77 100.58,32.77 81.79,32.77 13.72,1.02 13.72,27.18 1.02,36.32 2.03,56.13 12.19,62.23 34.04,126.49 146.81,126.49 146.81,1.02 69.6,42.93 64.52,55.88 57.91,54.86 58.17,65.02 58.17,63.5 58.17,67.31 62.99,65.02 62.99,63.5 65.28,72.14 60.71,72.14 62.99,66.55 67.56,65.28 71.88,71.88 71.88,65.02 76.45,65.02 71.88,63.5 76.45,63.5 67.56,63.5 51.82,66.29 70.1,75.18 77.98,71.88 76.2,75.18 70.1,78.74 70.1,80.26 76.2,80.26 76.2,78.74 62.99,77.22 57.66,77.22 55.88,82.04 60.45,81.53 55.63,72.14 90.68,59.44 93.22,57.15 105.16,72.14 104.9,74.93 105.66,82.3 107.7,76.96 109.98,74.93 34.04,92.46 112.78,76.96 109.73,82.04 110.24,72.14 107.44,61.72 102.36,61.72 96.01,61.72 130.3,61.98 134.87,61.98 139.95,61.98 140.21,67.06 135.13,67.06 119.38,80.26 119.38,78.74 119.38,75.18 120.14,72.14 102.87,75.69 102.87,78.74 103.38,80.52 92.71,78.49 93.22,73.41 90.42,69.85 93.22,70.61 100.08,70.87 100.33,73.41 48.77,90.42 45.21,92.46 90.68,94.49 93.47,91.69 102.87,112.78 107.7,112.78 105.16,107.7 93.22,108.97 93.22,105.92 100.33,106.43 102.36,97.54 95.76,97.28 107.44,97.54 112.52,97.54 117.35,97.54 124.46,97.54 129.79,97.54 134.87,97.54 139.95,97.54 135.64,102.62 137.67,107.7 135.64,112.78 130.56,115.82 130.56,112.78 80.77,116.08 135.64,115.82 132.59,107.7 130.56,102.62 125.73,102.62 123.44,103.89 123.19,105.92 119.63,108.97 119.38,111 125.98,111 117.35,112.78 112.78,112.78 127.51,107.7 110.24,107.7 114.81,107.7 105.41,117.6 110.24,117.35 60.71,117.35 67.06,115.57 68.07,112.52 65.28,110.49 65.28,107.7 62.99,112.78 60.71,107.7 57.91,112.78 55.63,107.7 52.83,102.36 57.91,102.36 63.25,102.11 67.56,100.84 62.99,97.54 57.91,97.54 52.83,97.54 52.32,112.78 44.2,112.01 44.2,107.19 49.78,107.7 44.2,101.85 48.26,101.85 135.13,53.34 140.21,52.58 133.6,37.85 63.75,37.34 120.14,30.73 142.49,61.98 142.49,75.44 124.71,78.74 124.71,80.26 92.71,114.05 86.11,116.08 92.71,111 100.33,108.97 103.38,116.08 90.42,111.25 90.42,105.41 90.42,97.54 85.85,98.04 81.03,98.04 74.42,98.04 67.56,97.54 77.98,107.44 83.06,107.44 88.14,107.44 80.77,112.78 86.11,112.78 75.18,112.52 70.61,112.52 71.88,107.7 91.19,115.57 104.14,83.57 54.61,83.57 48.77,51.82 32.51,38.1 30.23,35.81 27.94,33.53 29.72,54.86 27.94,53.09 95.76,126.49 95.5,5.33 114.3,5.33 76.96,5.33 49.78,22.1 49.78,18.03 41.66,20.07 38.61,19.3 34.04,23.11 32.77,24.89 25.4,27.18 25.4,36.32 27.94,29.97 19.56,36.32 13.72,36.32 19.56,27.18 19.56,38.35 13.72,38.35 25.4,38.35 2.03,41.15 1.02,39.37 143,92.96 98.04,92.71 96.27,37.59 140.72,46.23 88.39,53.59 96.52,52.83 103.89,52.07 115.06,51.31 123.95,51.31 132.84,51.31 33.02,54.36 37.08,56.64 33.53,32.26 32.77,13.21 35.31,12.19 38.1,13.97 58.17,11.18 58.17,13.72 86.36,11.18 86.36,13.72 104.9,11.18 104.9,13.72 123.7,13.72 135.89,13.72 135.89,11.18 123.7,11.18 81.03,80.26 86.11,80.26 88.14,71.88 86.11,77.22 81.03,77.22 83.31,71.88 81.03,63.5 85.85,62.74 82.55,41.91 82.55,46.23 91.44,41.4 91.44,46.23 100.33,46.23 100.33,40.89 109.22,46.23 109.22,40.39 118.11,46.23 118.11,39.88 127,46.23 127,39.37 135.89,46.23
  pour Bottom (isolate 0.254): -6.78,130.92 151.66,130.92 151.66,-7.38 -6.78,-7.38
  pour Top (isolate 0.254): -4.78,128.92 149.95,128.79 149.95,-3.51 -4.78,-3.38
N$1
  Top 0.254: R1.1 A0.A
N$2
  Top 0.254: R2.1 A1.A
N$3
  Top 0.254: R3.1 A2.A
N$4
  Top 0.254: R4.1 A3.A
N$5
  Top 0.254: R5.1 A4.A
N$8
  Top 0.254: R6.1 A5.A
N$9
  Top 0.254: A6.A R7.1
N$10
  Top 0.254: A7.A R8.1
N$11
  Top 0.254: R25.1 FOCUS.A
N$12
  Top 0.254: B0.A R9.1
N$13
  Top 0.254: B1.A R10.1
N$14
  Top 0.254: B2.A R11.1
N$15
  Top 0.254: B3.A R12.1
N$16
  Top 0.254: B4.A R13.1
N$17
  Top 0.254: B5.A R14.1
N$18
  Top 0.254: B6.A R15.1
N$19
  Top 0.254: R16.1 B7.A
N$20
  Top 0.254: R17.1 C0.A
N$21
  Top 0.254: R18.1 C1.A
N$22
  Top 0.254: R19.1 C2.A
N$23
  Top 0.254: R20.1 C3.A
N$24
  Top 0.254: R21.1 C4.A
N$25
  Top 0.254: R22.1 C5.A
N$26
  Top 0.254: R23.1 C6.A
N$27
  Top 0.254: R24.1 C7.A
N$28
  Top 0.254: R26.1 SHUTTER.A
N$31
  Top 0.254: U1.P$2 72.06,44.72 R27.2
N$38
  Top 0.254: U2.P$2 80.95,44.72 R28.2
N$42  (via drill 0.3 pad 0.61)
  Top 0.254: QA0.A v49.78,99.82 R35.1 | v87.88,99.82 QA21.A | QA1.A v54.86,99.82 | QA2.A v59.94,99.82 | QA3.A v65.02,99.82 | QA4.A v70.1,99.82 | QA19.A v77.72,99.82 | QA20.A v82.8,99.82
  Bottom 0.254: v49.78,99.82 v54.86,99.82 v59.94,99.82 v65.02,99.82 v70.1,99.82 v77.72,99.82 v82.8,99.82 v87.88,99.82
N$43  (via drill 0.3 pad 0.61)
  Top 0.254: QA5.A v49.78,105.16 R36.1 | v54.86,105.16 QA6.A | QA7.A v59.94,105.16 | QA8.A v65.02,105.16 | QA9.A v70.1,105.16 | QA22.A v77.72,105.16 | QA23.A v82.8,105.16 | QA24.A v87.88,105.16
  Bottom 0.254: v49.78,105.16 v54.86,105.16 v59.94,105.16 v65.02,105.16 v70.1,105.16 v77.72,105.16 v82.8,105.16 v87.88,105.16
N$44  (via drill 0.3 pad 0.61)
  Top 0.254: QA10.A v52.32,109.98 R37.1 | v57.4,109.98 QA11.A | QA12.A v62.48,109.98 | QA13.A v67.56,109.98 | QA25.A v75.18,109.98 | QA26.A v80.26,109.98 | QA27.A v85.34,109.98 | QA28.A v90.42,109.98
  Bottom 0.254: v52.32,109.98 v57.4,109.98 v62.48,109.98 63.75,109.98 64.01,109.73 66.04,109.73 66.29,109.98 v67.56,109.98 v75.18,109.98 v80.26,109.98 v85.34,109.98 v90.42,109.98
N$45  (via drill 0.3 pad 0.61)
  Top 0.254: QA14.A v54.86,115.06 | v59.94,115.06 QA15.A | QA16.A v65.02,115.06 | QA29.A v77.72,115.06 | QA30.A v82.8,115.06 | QA31.A v87.88,115.06 | v54.86,115.06 54.86,117.86 55.88,118.87 57.37,118.87 QA17.A 57.4,118.87 62.45,118.87 QA18.A | R38.1 v54.86,115.06
  Bottom 0.254: v54.86,115.06 v59.94,115.06 v65.02,115.06 66.29,115.06 66.8,114.55 68.33,114.55 68.83,115.06 v77.72,115.06 v82.8,115.06 v87.88,115.06
N$46
  Top 0.254: U3.P$2 89.84,44.64 R29.2
N$55  (via drill 0.3 pad 0.61)
  Top 0.254: QB0.A v99.31,99.82 R39.1 | v104.39,99.82 QB1.A | QB2.A v109.47,99.82 | QB3.A v114.55,99.82 | QB4.A v119.63,99.82 | QB19.A v127.25,99.82 | QB20.A v132.33,99.82 | QB21.A v137.41,99.82
  Bottom 0.254: v99.31,99.82 v104.39,99.82 v109.47,99.82 v114.55,99.82 v119.63,99.82 v127.25,99.82 v132.33,99.82 v137.41,99.82
N$56  (via drill 0.3 pad 0.61)
  Top 0.254: QB5.A v99.31,105.16 R40.1 | v104.39,105.16 QB6.A | QB7.A v109.47,105.16 | QB8.A v114.55,105.16 | QB9.A v119.63,105.16 | QB22.A v127.25,105.16 | QB23.A v132.33,105.16 | QB24.A v137.41,105.16
  Bottom 0.254: v99.31,105.16 v104.39,105.16 v109.47,105.16 v114.55,105.16 v119.63,105.16 v127.25,105.16 v132.33,105.16 v137.41,105.16
N$57  (via drill 0.3 pad 0.61)
  Top 0.254: QB10.A v101.85,109.98 R41.1 | v106.93,109.98 QB11.A | QB12.A v112.01,109.98 | QB13.A v117.09,109.98 | QB25.A v124.71,109.98 | QB26.A v129.79,109.98 | QB27.A v134.87,109.98 | QB28.A v139.95,109.98
  Bottom 0.254: v101.85,109.98 v106.93,109.98 v112.01,109.98 v117.09,109.98 v124.71,109.98 v129.79,109.98 v134.87,109.98 v139.95,109.98
N$58  (via drill 0.3 pad 0.61)
  Top 0.254: QB14.A v104.39,115.06 | v109.47,115.06 QB15.A | QB16.A v114.55,115.06 | QB29.A v127.25,115.06 | QB30.A v132.33,115.06 | QB31.A v137.41,115.06 | QB18.A 111.98,118.87 106.97,118.87 QB17.A 106.93,118.87 105.41,118.87 104.39,117.86 v104.39,115.06 | R42.1 v104.39,115.06
  Bottom 0.254: v137.41,115.06 v132.33,115.06 v127.25,115.06 v114.55,115.06 v109.47,115.06 v104.39,115.06
N$67  (via drill 0.3 pad 0.61)
  Top 0.254: QC0.A v49.78,64.26 | v54.86,64.26 QC1.A | QC2.A v59.94,64.26 | QC3.A v65.02,64.26 | QC4.A v70.1,64.26 | QC19.A v77.72,64.26 | QC20.A v82.8,64.26 | QC21.A v87.88,64.26 | R43.1 50.29,59.44 51.82,60.96 v51.82,64.26
  Bottom 0.254: v49.78,64.26 v51.82,64.26 v54.86,64.26 v59.94,64.26 v65.02,64.26 v70.1,64.26 v77.72,64.26 v82.8,64.26 v87.88,64.26
N$68  (via drill 0.3 pad 0.61)
  Top 0.254: QC5.A v49.78,69.6 | v54.86,69.6 QC6.A | QC7.A v59.94,69.6 | QC8.A v65.02,69.6 | QC9.A v70.1,69.6 | QC22.A v77.72,69.6 | QC23.A v82.8,69.6 | QC24.A v87.88,69.6 | v52.58,69.6 52.58,60.45 52.32,60.2 R44.1
  Bottom 0.254: v49.78,69.6 v52.58,69.6 v54.86,69.6 v59.94,69.6 v65.02,69.6 v70.1,69.6 v77.72,69.6 v82.8,69.6 v87.88,69.6
N$69  (via drill 0.3 pad 0.61)
  Top 0.254: QC10.A v52.32,74.42 | v57.4,74.42 QC11.A | QC12.A v62.48,74.42 | QC13.A v67.56,74.42 | QC25.A v75.18,74.42 | QC26.A v80.26,74.42 | QC27.A v85.34,74.42 | QC28.A v90.42,74.42 | R45.1 54.36,59.44 53.34,60.45 53.34,70.1 54.36,71.12 v54.36,74.42
  Bottom 0.254: v52.32,74.42 v54.36,74.42 v57.4,74.42 v62.48,74.42 v67.56,74.42 v75.18,74.42 v80.26,74.42 v85.34,74.42 v90.42,74.42
N$70  (via drill 0.3 pad 0.61)
  Top 0.254: QC14.A v54.86,79.5 54.86,82.3 55.88,83.31 57.4,83.31 | QC18.A 62.48,83.31 57.4,83.31 | 57.4,83.31 QC17.A | QC15.A v59.94,79.5 | QC16.A v65.02,79.5 | QC29.A v77.72,79.5 | QC30.A v82.8,79.5 | QC31.A v87.88,79.5 | v61.21,79.5 61.21,75.44 59.18,73.41 59.18,70.87 56.9,68.58 56.9,60.71 56.39,60.2 R46.1
  Bottom 0.254: v54.86,79.5 v59.94,79.5 v61.21,79.5 v65.02,79.5 v77.72,79.5 v82.8,79.5 v87.88,79.5
N$79  (via drill 0.3 pad 0.61)
  Top 0.254: QD0.A v99.31,64.26 R47.1 | v104.39,64.26 QD1.A | QD2.A v109.47,64.26 | QD3.A v114.55,64.26 | QD4.A v119.63,64.26 | QD19.A v127.25,64.26 | QD20.A v132.33,64.26 | QD21.A v137.41,64.26
  Bottom 0.254: v99.31,64.26 v104.39,64.26 v109.47,64.26 v114.55,64.26 v119.63,64.26 v127.25,64.26 v132.33,64.26 v137.41,64.26
N$80  (via drill 0.3 pad 0.61)
  Top 0.254: QD5.A v99.31,69.6 R48.1 | v104.39,69.6 QD6.A | QD7.A v109.47,69.6 | QD8.A v114.55,69.6 | QD9.A v119.63,69.6 | QD22.A v127.25,69.6 | QD23.A v132.33,69.6 | QD24.A v137.41,69.6
  Bottom 0.254: v99.31,69.6 v104.39,69.6 v109.47,69.6 v114.55,69.6 115.82,69.6 116.33,69.09 117.86,69.09 118.36,69.6 v119.63,69.6 124.21,69.6 124.97,68.83 125.73,68.83 126.49,69.6 v127.25,69.6 128.52,69.6 129.03,69.09 130.56,69.09 131.06,69.6 v132.33,69.6 133.6,69.6 134.11,69.09 135.64,69.09 136.14,69.6 v137.41,69.6
N$81  (via drill 0.3 pad 0.61)
  Top 0.254: QD10.A v101.85,74.42 R49.1 | v106.93,74.42 QD11.A | QD12.A v112.01,74.42 | QD13.A v117.09,74.42 | QD25.A v124.71,74.42 | QD26.A v129.79,74.42 | QD27.A v134.87,74.42 | QD28.A v139.95,74.42
  Bottom 0.254: v139.95,74.42 138.68,74.42 138.43,74.17 136.4,74.17 136.14,74.42 v134.87,74.42 133.86,74.42 133.6,74.17 131.32,74.17 131.06,74.42 v129.79,74.42 128.78,74.42 128.52,74.17 125.98,74.17 125.73,74.42 v124.71,74.42 v117.09,74.42 116.08,74.42 115.82,74.17 113.28,74.17 113.03,74.42 v112.01,74.42 111.25,74.42 111,74.17 108.46,74.17 108.2,74.42 v106.93,74.42 106.17,74.42 105.92,74.17 103.38,74.17 103.12,74.42 v101.85,74.42
N$82  (via drill 0.3 pad 0.61)
  Top 0.254: QD14.A v104.39,79.5 | v109.47,79.5 QD15.A | QD16.A v114.55,79.5 | 106.93,83.31 105.41,83.31 104.39,82.3 v104.39,79.5 | QD18.A 111.98,83.31 106.93,83.31 | 106.93,83.31 QD17.A | QD29.A v127.25,79.5 | QD30.A v132.33,79.5 | QD31.A v137.41,79.5 | R50.1 v104.39,79.5
  Bottom 0.254: v104.39,79.5 v109.47,79.5 v114.55,79.5 v127.25,79.5 v132.33,79.5 v137.41,79.5
N$83
  Top 0.254: U4.P$2 98.73,44.72 R30.2
N$84
  Top 0.254: U5.P$2 107.62,44.72 R31.2
N$85
  Top 0.254: U6.P$2 116.51,44.72 R32.2
N$86
  Top 0.254: U7.P$2 125.4,44.72 R33.2
N$87
  Top 0.254: U8.P$2 134.29,44.72 R34.2
PB1
  Top 0.254: ICSP.3 9.02,43.69 9.02,49.78 ICSP1.3
PB2
  Top 0.254: ICSP.4 3.94,43.69 3.94,49.78 ICSP1.4
PB3
  Top 0.254: ICSP.1 6.48,41.15 6.48,47.24 ICSP1.1
RESET
  Top 0.254: RESET.2 RESET.1
  Bottom 0.254: ICSP1.5 6.48,52.32 6.48,46.23 ICSP.5 13.72,44.96 14.48,45.72 14.48,48.01 15.47,49 RESET.1
SHUTTER
  Top 0.254: JP4.2 R26.2
SW1  (via drill 0.3 pad 0.61)
  Top 0.254: STOP.2 STOP.1 | JP3.7 22.1,59.18 32,59.18 v35.56,55.63
  Bottom 0.254: v35.56,55.63 36.07,55.12 36.07,13.72 37.59,12.19 124.46,12.19 125.75,10.9 STOP.1
SW2
  Top 0.254: GO.2 GO.1
  Bottom 0.254: JP3.9 24.64,59.18 33.02,59.18 36.58,55.63 36.58,13.97 37.85,12.7 136.4,12.7 138.2,10.9 GO.1
SW3
  Top 0.254: UP.2 UP.1
  Bottom 0.254: JP3.11 27.69,56.13 32.51,56.13 34.54,54.1 34.54,25.15 32.49,23.09 UP.2
SW4
  Top 0.254: DOWN.2 DOWN.1
  Bottom 0.254: JP3.13 29.72,56.64 32.77,56.64 35.05,54.36 35.05,13.46 32.49,10.9 DOWN.2
SW5
  Top 0.254: FOCUSON.2 FOCUSON.1
  Bottom 0.254: JP3.15 32.26,57.91 35.56,54.61 35.56,13.46 38.12,10.9 FOCUSON.1
TXD2
  Top 0.254: JP3.5 19.56,56.64 26.16,56.64 30.73,52.07 30.73,38.35 32.51,36.58 LCD1.P$1

## Text on the board
tNames: Quarter A | Quarter B | SuperDome / Extension | SuperDome / Extension | Quarter C | Quarter D | SuperDome / Extension | SuperDome / Extension | 5V | G | R | G | G | G | G | G | C | D | T | 1 | 2 | 3 | 4 | 5 | GND.6 | 5.!RST | SI.4 | 3.SCK | VCC.2 | 1.MI | RTIduino Tester | v1.0 | University of Southampton | Graeme Bragg, / Kirk Martinez